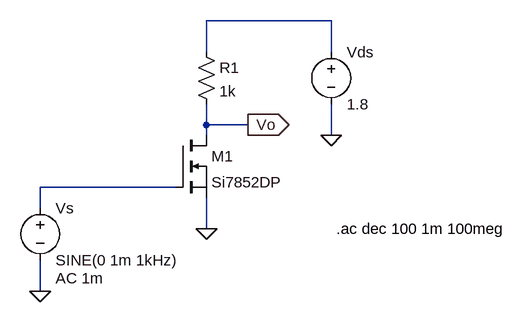
[diagram p0: schematic NMOS f.asc]
NMOS f.asc, the LTspice schematic file:
Version 4
SHEET 1 880 680
WIRE 368 -96 176 -96
WIRE 176 -48 176 -96
WIRE 368 -48 368 -96
WIRE 176 64 176 32
WIRE 240 64 176 64
WIRE 176 80 176 64
WIRE 368 80 368 32
WIRE 128 160 -80 160
WIRE -80 192 -80 160
WIRE 176 224 176 176
WIRE -80 320 -80 272
FLAG 176 224 0
FLAG 368 80 0
FLAG -80 320 0
FLAG 240 64 Vo
IOPIN 240 64 Out
SYMBOL nmos 128 80 R0
SYMATTR InstName M1
SYMATTR Value Si7852DP
SYMBOL voltage 368 -64 R0
WINDOW 123 0 0 Left 0
WINDOW 39 0 0 Left 0
SYMATTR InstName Vds
SYMATTR Value 1.8
SYMBOL voltage -80 176 R0
WINDOW 123 24 124 Left 2
WINDOW 39 0 0 Left 0
SYMATTR InstName Vs
SYMATTR Value SINE(0 1m 1kHz)
SYMATTR Value2 AC 1m
SYMBOL res 160 -64 R0
SYMATTR InstName R1
SYMATTR Value 1k
TEXT 376 224 Left 2 !.ac dec 100 1m 100meg

The netlist it stands for:
* NMOS f.asc
M1 Vo N002 0 0 Si7852DP
Vds N001 0 1.8
Vs N002 0 SINE(0 1m 1kHz) AC 1m
R1 N001 Vo 1k
.model NMOS NMOS
.model PMOS PMOS
.lib standard.mos
.ac dec 100 1m 100meg
.backanno
.end